# Altium schematic sheet baymaxother.SchDoc
size A4
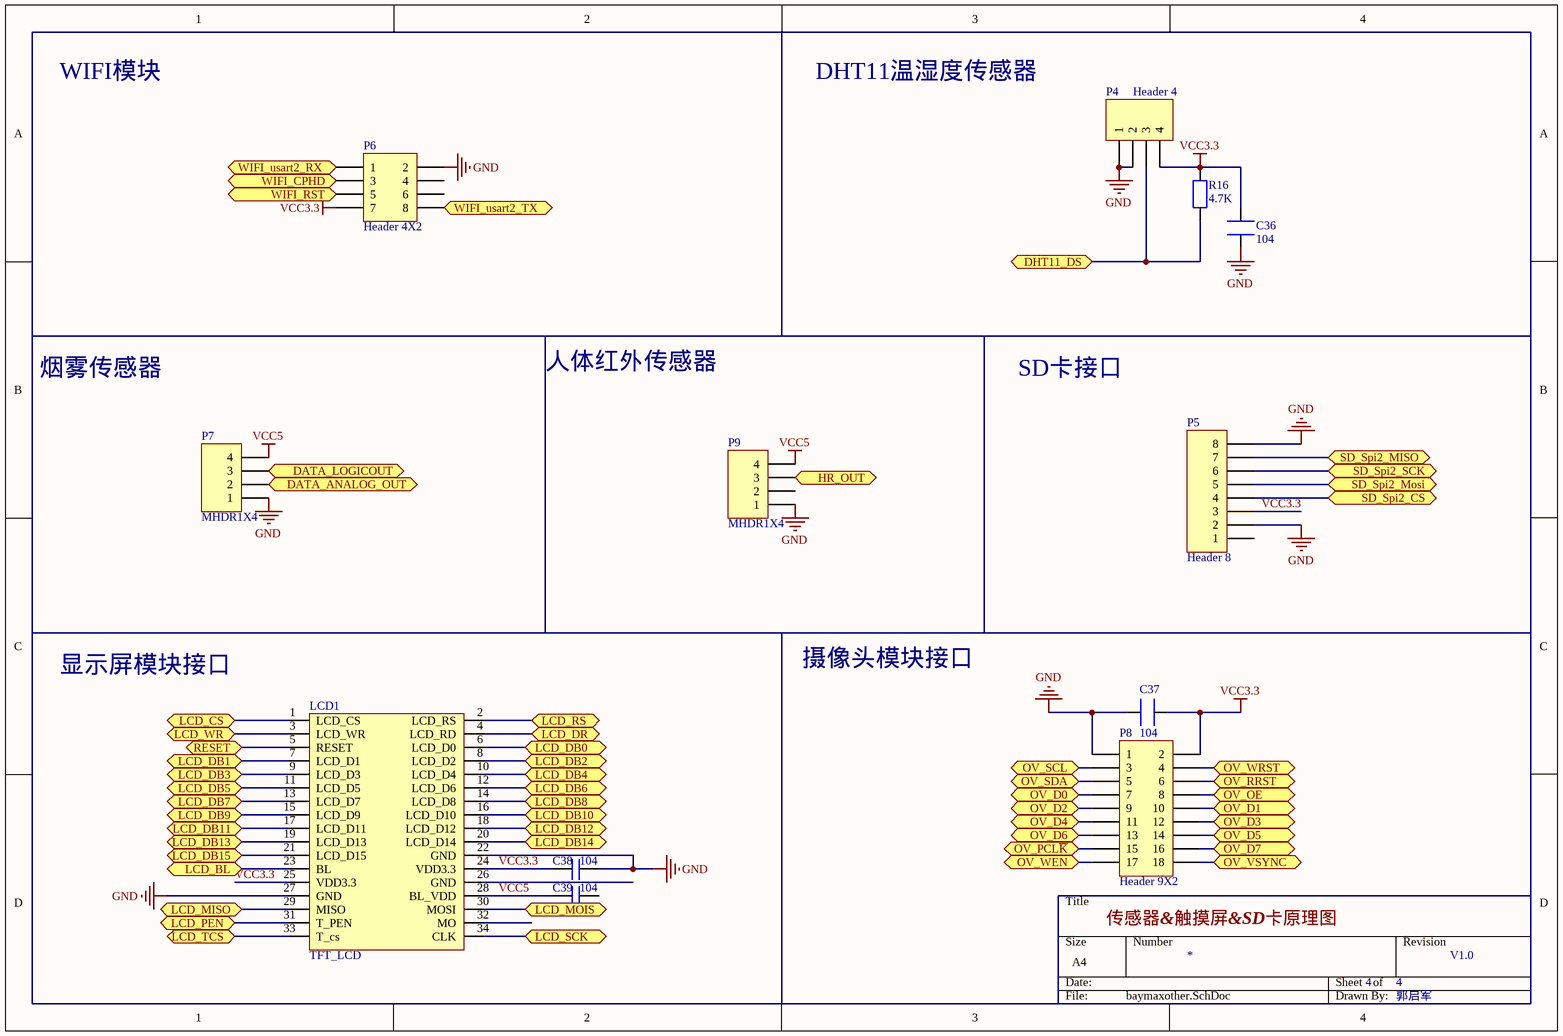
[diagram p0: baymaxother.SchDoc]

## Parts
C36  104  [0805-bottom layer]
C37  104  [0805-bottom layer]
C38  104  [0805-bottom layer]
C39  104  [0805-bottom layer]
LCD1  TFT_LCD  [HDR2X17]
P4  Header 4  [HDR1X4]
P5  Header 8  [HDR1X8]
P6  Header 4X2  [HDR2X4]
P7  MHDR1X4  [MHDR1X4]
P8  Header 9X2  [HDR2X9]
P9  MHDR1X4  [MHDR1X4]
R16  4.7K  [0805-bottom layer]

## Ports
DATA_ANALOG_OUT, DATA_LOGICOUT, DHT11_DS, HR_OUT, LCD_BL, LCD_CS, LCD_DB0, LCD_DB1, LCD_DB2, LCD_DB3, LCD_DB4, LCD_DB5, LCD_DB6, LCD_DB7, LCD_DB8, LCD_DB9, LCD_DB10, LCD_DB11, LCD_DB12, LCD_DB13, LCD_DB14, LCD_DB15, LCD_DR, LCD_MISO, LCD_MOIS, LCD_PEN, LCD_RS, LCD_SCK, LCD_TCS, LCD_WR, OV_D0, OV_D1, OV_D2, OV_D3, OV_D4, OV_D5, OV_D6, OV_D7, OV_OE, OV_PCL~{K}, OV_RRST, OV_SCL, OV_SDA, OV_VSYNC, OV_WEN, OV_WRST, RESET, SD_Spi2_CS, SD_Spi2_MISO, SD_Spi2_Mosi, SD_Spi2_SCK, WIFI_CPHD, WIFI_RST, WIFI_usart2_RX, WIFI_usart2_TX

## Nets
GND: C36.2 C37.2 C38.2 LCD1.22(GND) LCD1.27(GND) P4.1 P4.2 P5.2 P5.8 P6.2 P7.1 P8.1 P9.1
VCC3.3: C36.1 C37.1 C38.1 LCD1.24(VDD3.3) LCD1.25(VDD3.3) P4.4 P5.3 P6.7 P8.2 R16.1
VCC5: C39.1 LCD1.28(BL_VDD) P7.4 P9.4
DATA_ANALOG_OUT: P7.2 ; port DATA_ANALOG_OUT
DATA_LOGICOUT: P7.3 ; port DATA_LOGICOUT
DHT11_DS: P4.3 R16.2 ; port DHT11_DS
HR_OUT: P9.3 ; port HR_OUT
LCD_BL: LCD1.23(BL) ; port LCD_BL
LCD_CS: LCD1.1(LCD_CS) ; port LCD_CS
LCD_DB0: LCD1.6(LCD_D0) ; port LCD_DB0
LCD_DB1: LCD1.7(LCD_D1) ; port LCD_DB1
LCD_DB2: LCD1.8(LCD_D2) ; port LCD_DB2
LCD_DB3: LCD1.9(LCD_D3) ; port LCD_DB3
LCD_DB4: LCD1.10(LCD_D4) ; port LCD_DB4
LCD_DB5: LCD1.11(LCD_D5) ; port LCD_DB5
LCD_DB6: LCD1.12(LCD_D6) ; port LCD_DB6
LCD_DB7: LCD1.13(LCD_D7) ; port LCD_DB7
LCD_DB8: LCD1.14(LCD_D8) ; port LCD_DB8
LCD_DB9: LCD1.15(LCD_D9) ; port LCD_DB9
LCD_DB10: LCD1.16(LCD_D10) ; port LCD_DB10
LCD_DB11: LCD1.17(LCD_D11) ; port LCD_DB11
LCD_DB12: LCD1.18(LCD_D12) ; port LCD_DB12
LCD_DB13: LCD1.19(LCD_D13) ; port LCD_DB13
LCD_DB14: LCD1.20(LCD_D14) ; port LCD_DB14
LCD_DB15: LCD1.21(LCD_D15) ; port LCD_DB15
LCD_DR: LCD1.4(LCD_RD) ; port LCD_DR
LCD_MISO: LCD1.29(MISO) ; port LCD_MISO
LCD_MOIS: LCD1.30(MOSI) ; port LCD_MOIS
LCD_PEN: LCD1.31(T_PEN) ; port LCD_PEN
LCD_RS: LCD1.2(LCD_RS) ; port LCD_RS
LCD_SCK: LCD1.34(CLK) ; port LCD_SCK
LCD_TCS: LCD1.33(T_cs) ; port LCD_TCS
LCD_WR: LCD1.3(LCD_WR) ; port LCD_WR
OV_D0: P8.7 ; port OV_D0
OV_D1: P8.10 ; port OV_D1
OV_D2: P8.9 ; port OV_D2
OV_D3: P8.12 ; port OV_D3
OV_D4: P8.11 ; port OV_D4
OV_D5: P8.14 ; port OV_D5
OV_D6: P8.13 ; port OV_D6
OV_D7: P8.16 ; port OV_D7
OV_OE: P8.8 ; port OV_OE
OV_PCL~{K}: P8.15 ; port OV_PCL~{K}
OV_RRST: P8.6 ; port OV_RRST
OV_SCL: P8.3 ; port OV_SCL
OV_SDA: P8.5 ; port OV_SDA
OV_VSYNC: P8.18 ; port OV_VSYNC
OV_WEN: P8.17 ; port OV_WEN
OV_WRST: P8.4 ; port OV_WRST
RESET: LCD1.5(RESET) ; port RESET
SD_Spi2_CS: P5.4 ; port SD_Spi2_CS
SD_Spi2_MISO: P5.7 ; port SD_Spi2_MISO
SD_Spi2_Mosi: P5.5 ; port SD_Spi2_Mosi
SD_Spi2_SCK: P5.6 ; port SD_Spi2_SCK
WIFI_CPHD: P6.3 ; port WIFI_CPHD
WIFI_RST: P6.5 ; port WIFI_RST
WIFI_usart2_RX: P6.1 ; port WIFI_usart2_RX
WIFI_usart2_TX: P6.8 ; port WIFI_usart2_TX

Not connected (* = marked no-connect by the designer): C39 2; LCD1 26(GND) 32(MO); P5 1; P6 4 6; P9 2

## Notes on the sheet
- WIFI模块
- DHT11温湿度传感器
- 烟雾传感器
- 人体红外传感器
- SD卡接口
- 显示屏模块接口
- 摄像头模块接口
- (near P8) 传感器&触摸屏&SD卡原理图
- *
- 4
- V1.0
- 郭启军

## Library data of the parts
C36 C37 = 104: 电容
C38 C39 = C
P4 = Header 4: Header, 4-Pin; LatestRevisionDate: 17-Jul-2002; LatestRevisionNote: Re-released for DXP Platform.; Publisher: Altium Limited
P5 = Header 8: Header, 8-Pin; LatestRevisionDate: 17-Jul-2002; LatestRevisionNote: Re-released for DXP Platform.; Publisher: Altium Limited
P6 = Header 4X2: Header, 4-Pin, Dual row; LatestRevisionDate: 17-Jul-2002; LatestRevisionNote: Re-released for DXP Platform.; Publisher: Altium Limited
P7 P9 = MHDR1X4: Header, 4-Pin; LatestRevisionDate: 17-Jul-2002; LatestRevisionNote: Re-released for DXP Platform.; Publisher: Altium Limited
P8 = Header 9X2: Header, 9-Pin, Dual row; LatestRevisionDate: 17-Jul-2002; LatestRevisionNote: Re-released for DXP Platform.; Publisher: Altium Limited
R16 = 4.7K: 电阻